# EAGLE design SelfBus DAP Debugger (EAGLE 9.6.2)
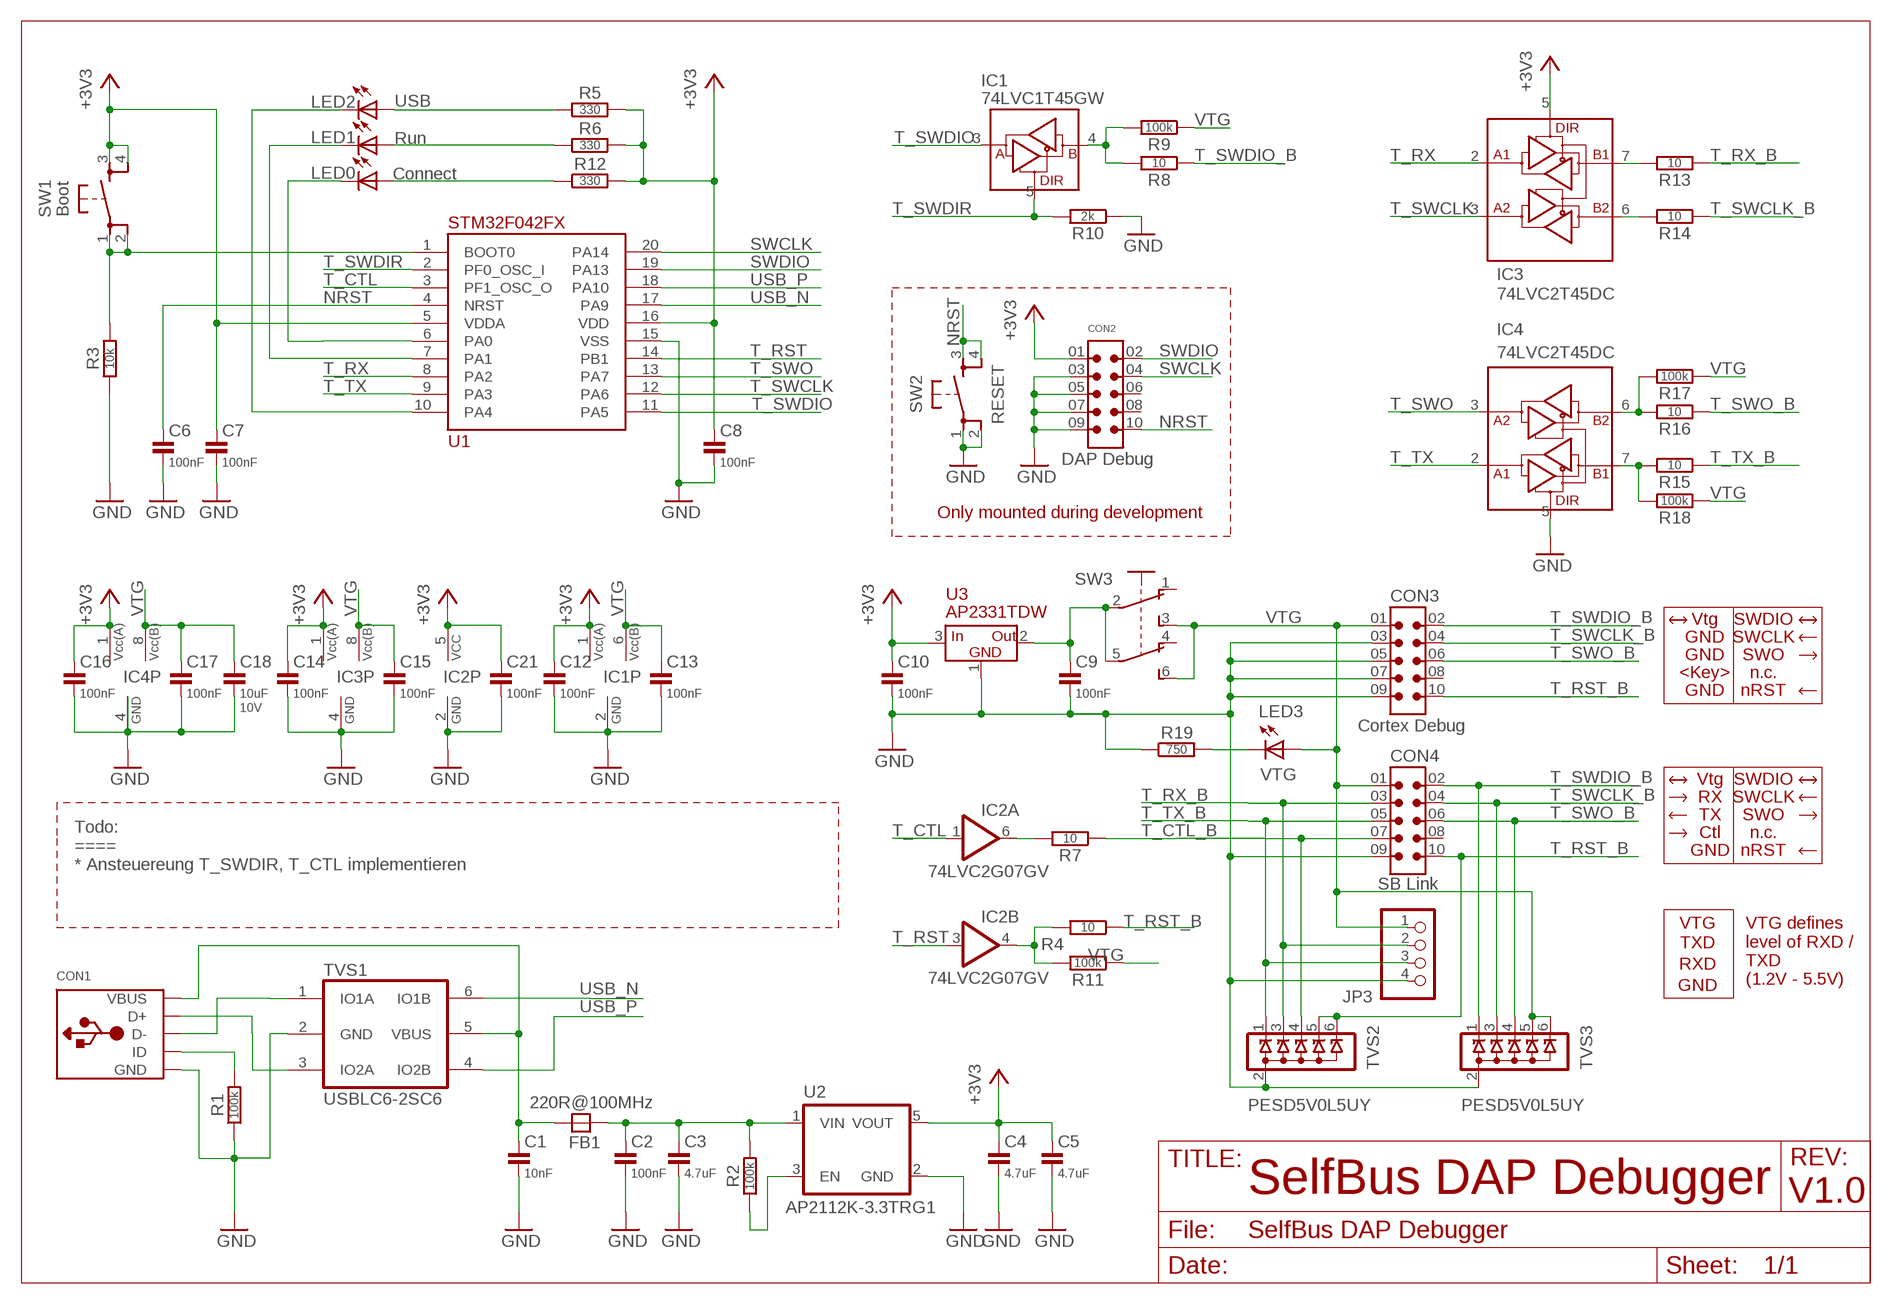
[diagram p0: schematic, sheet 1]

## Parts
C1  10nF  C-EUC0805  [C0805]
C2  100nF  C-EUC0805  [C0805]
C3  4.7uF  C-EUC0805  [C0805]
C4  4.7uF  C-EUC0805  [C0805]
C5  4.7uF  C-EUC0805  [C0805]
C6  100nF  C-EUC0805  [C0805]
C7  100nF  C-EUC0805  [C0805]
C8  100nF  C-EUC0805  [C0805]
C9  100nF  C-EUC0805  [C0805]
C10  100nF  C-EUC0805  [C0805]
C12  100nF  C-EUC0805  [C0805]
C13  100nF  C-EUC0805  [C0805]
C14  100nF  C-EUC0805  [C0805]
C15  100nF  C-EUC0805  [C0805]
C16  100nF  C-EUC0805  [C0805]
C17  100nF  C-EUC0805  [C0805]
C18  10uF  C-EUC0805  [C0805]
C21  100nF  C-EUC0805  [C0805]
CON1  MICRO-B_U254-051N-4BH806  [U254-051N-4BH806]
CON2  SHF-105-01-X-D-TH  [SAMTEC_SHF-105-01-X-D-TH]
CON3  SHF-105-01-X-D-TH  [SAMTEC_SHF-105-01-X-D-TH]
CON4  SAMTEC-LTMM-105-02-T-D  [SAMTEC-LTMM-105-02-T-D]
FB1  220R@100MHz  FB  [FB0805]
IC1  74LVC1T45GW  [SOT363]
IC2  74LVC2G07GV  [SOT23-6]
IC3  74LVC2T45DC  [VSSOP8(0.5)]
IC4  74LVC2T45DC  [VSSOP8(0.5)]
JP3  PINHD-1X4  [1X04]
LED0  Connect  LED_3MM(T1)_GREEN  [LED_3MM_GREEN]
LED1  Run  LED_3MM(T1)_YELLOW  [LED_3MM_YELLOW]
LED2  USB  LED_3MM(T1)_GREEN  [LED_3MM_GREEN]
LED3  VTG  LED_3MM(T1)_RED  [LED_3MM_RED]
R1  100k  R-EU_R0805  [R0805]
R2  100k  R-EU_R0805  [R0805]
R3  10k  R-EU_R0805  [R0805]
R4  10  R-EU_R0805  [R0805]
R5  330  R-EU_R0805  [R0805]
R6  330  R-EU_R0805  [R0805]
R7  10  R-EU_R0805  [R0805]
R8  10  R-EU_R0805  [R0805]
R9  100k  R-EU_R0805  [R0805]
R10  2k  R-EU_R0805  [R0805]
R11  100k  R-EU_R0805  [R0805]
R12  330  R-EU_R0805  [R0805]
R13  10  R-EU_R0805  [R0805]
R14  10  R-EU_R0805  [R0805]
R15  10  R-EU_R0805  [R0805]
R16  10  R-EU_R0805  [R0805]
R17  100k  R-EU_R0805  [R0805]
R18  100k  R-EU_R0805  [R0805]
R19  750  R-EU_R0805  [R0805]
SW1  BOOT  ALPS_SKHHDHA010  [TACT_SWITCH_6X6_SNAP-IN_17]
SW2  RESET  ALPS_SKHHDHA010  [TACT_SWITCH_6X6_SNAP-IN_17]
SW3  XKB7070-Z  [XKB7070]
TVS1  USBLC6-2SC6  [SOT-23-6L]
TVS2  PESD5V0L5UY  [SOT363]
TVS3  PESD5V0L5UY  [SOT363]
U1  STM32F042FX  [TSSOP20]
U2  AP2112K-3.3TRG1  [SOT23-5]
U3  AP2331TDW  [SC59]

## Nets
+3V3: C4.1 C5.1 C7.1 C8.1 C10.1 C12.1 C14.1 C16.1 C21.1 CON2.01 IC1.1(VCC(A)) IC2.5(P:VCC) IC3.1(VCC(A)) IC3.5(DIR) IC4.1(VCC(A)) R5.2 R6.2 R12.2 SW1.3 SW1.4 U1.5(VDDA) U1.16(VDD) U2.5(VOUT) U3.3(IN)
D_N [USB]: CON1.D- TVS1.1(IO1A)
D_P [USB]: CON1.D+ TVS1.3(IO2A)
GND: C1.2 C2.2 C3.2 C4.2 C5.2 C6.2 C7.2 C8.2 C9.2 C10.2 C12.2 C13.2 C14.2 C15.2 C16.2 C17.2 C18.2 C21.2 CON1.GND CON1.SCR@1(GND) CON1.SCR@2(GND) CON1.SCR@3(GND) CON1.SCR@4(GND) CON2.03 CON2.05 CON2.07 CON2.09 CON3.03 CON3.05 CON3.07 CON3.09 CON4.09 IC1.2(GND) IC2.2(P:GND) IC3.4(GND) IC4.4(GND) IC4.5(DIR) JP3.4 R1.1 R3.1 R10.1 R19.1 SW2.1 SW2.2 TVS1.2(GND) TVS2.2(A) TVS3.2(A) U1.15(VSS) U2.2(GND) U3.1(GND)
LED0: LED0.C U1.6(PA0)
LED1: LED1.C U1.7(PA1)
N$3: CON1.ID R1.2
N$4: C1.1 CON1.VBUS FB1.1 TVS1.5(VBUS)
N$6: R2.1 U2.3(EN)
N$7: C2.1 C3.1 FB1.2 R2.2 U2.1(VIN)
N$8: IC2.4(B:OUT) R4.2 R11.2
N$9: IC2.6(A:OUT) R7.2
N$10: R3.2 SW1.1 SW1.2 U1.1(BOOT0)
N$11: LED2.A R5.1
N$12: LED1.A R6.1
N$15: C9.1 SW3.2(P) SW3.5(P) U3.2(OUT)
N$17: LED0.A R12.1
N$18: IC3.7(B1) R13.2
N$19: IC3.6(B2) R14.2
N$20: IC4.6(B2) R16.2 R17.2
N$21: IC4.7(B1) R15.2 R18.2
N$22: IC1.4(B) R8.2 R9.2
N$23: LED2.C U1.10(PA4)
N$24: LED3.C R19.2
NRST: C6.1 CON2.10 SW2.3 SW2.4 U1.4(NRST)
SWCLK: CON2.04 U1.20(PA14)
SWDIO: CON2.02 U1.19(PA13)
T_CTL: IC2.1(A:IN) U1.3(PF1_OSC_O)
T_CTL_B: CON4.07 R7.1 TVS2.4(C3)
T_RST: IC2.3(B:IN) U1.14(PB1)
T_RST_B: CON3.10 CON4.10 R4.1 TVS2.5(C4) TVS2.6(C5)
T_RX: IC3.2(A1) U1.8(PA2)
T_RX_B: CON4.03 JP3.2 R13.1 TVS2.3(C2)
T_SWCLK: IC3.3(A2) U1.12(PA6)
T_SWCLK_B: CON3.04 CON4.04 R14.1 TVS3.3(C2)
T_SWDIO: IC1.3(A) U1.11(PA5)
T_SWDIO_B: CON3.02 CON4.02 R8.1 TVS3.1(C1)
T_SWDIR: IC1.5(DIR) R10.2 U1.2(PF0_OSC_I)
T_SWO: IC4.3(A2) U1.13(PA7)
T_SWO_B: CON3.06 CON4.06 R16.1 TVS3.4(C3)
T_TX: IC4.2(A1) U1.9(PA3)
T_TX_B: CON4.05 JP3.3 R15.1 TVS2.1(C1)
USB_N [USB]: TVS1.6(IO1B) U1.17(PA9)
USB_P [USB]: TVS1.4(IO2B) U1.18(PA10)
VTG: C13.1 C15.1 C17.1 C18.1 CON3.01 CON4.01 IC1.6(VCC(B)) IC3.8(VCC(B)) IC4.8(VCC(B)) JP3.1 LED3.A R9.1 R11.1 R17.1 R18.1 SW3.3(S) SW3.6(S) TVS3.5(C4) TVS3.6(C5)
Unconnected: CON2.06 CON2.08 CON3.08 CON4.08 SW3.1(O) SW3.4(O)

## Notes on the sheet
- Boot
- RESET
- DAP Debug
- Only mounted during development
- Vtg | SWDIO
- GND | SWCLK
- GND | SWO
- <Key> | n.c.
- GND | nRST
- Cortex Debug
- Vtg | SWDIO
- RX | SWCLK
- Todo:
  ====
  * Ansteuereung T_SWDIR, T_CTL implementieren
- TX | SWO
- Ctl | n.c.
- GND | nRST
- SB Link
- VTG defines
  level of RXD /
  TXD
  (1.2V - 5.5V)
- VTG
- TXD
- RXD
- GND
- SelfBus DAP Debugger | V1.0

## Library data of the parts
C1-C10 C12-C17 C21 = MyRCL:C-EU: CAPACITOR, European symbol; SPICEPREFIX: C
C18 = MyRCL:C-EU: CAPACITOR, European symbol; SPICEPREFIX: C; VOLTAGE: 10V
CON1 = MyCon-USB:MICRO-B: USB Micro-B Connector 5pin; LCSC#: C319170
CON2 CON3 = MyCon-Samtec:SHF-105-01-X-D-TH: Connector Header Through Hole 10 position 0.050" (1.27mm)
CON4 = MyCon-Samtec:SAMTEC-LTMM-105-02-T-D
FB1 = MyEMC-Components:FB: FERRITE BEAD; LCSC#2: C139188; MOUSER#: 810-MPZ2012S221ATD25; PART#: MPZ2012S221ATD25; PART#2: CBW201209U221T; PART_MFR: TDK; PART_MFR2: FH
IC1 = MyIC-Logic:74*1T45: 74LVC1T45; 74LVCH1T45 Dual supply translating transceiver; 3-state Single bit, dual supply transceiver with 3-state output for bidirectional level translation. 74LVCH1T45 holds unused or floating data inputs at a valid logiclevel. Datasheet <https://assets.nexperia.com/documents/data-sheet/74LVC_LVCH1T45.pdf>; LCSC#: C478004; LCSC#2: C548484; LCSC#3: C9382; MOUSER#: 771-74LVC1T45GW125; MOUSER#2: 771-74LVC1T45GWQ100H; MOUSER#3: 595-74LVC1T45QDCKRQ1; PART#: 74LVC1T45GW,125; PART#2: 74LVC1T45GW-Q100H; PART#3: SN74LVC1T45DCKR; PART_MFR: NXP; PART_MFR2: NXP; PART_MFR3: TI
IC2 = MyIC-Logic:74*2G07: Double Buffer/Driver with Open-Drain Output; LCSC#: C548568; MOUSER#: 771-LVC2G07GV125; PART#: 74LVC2G07GV,125; PART_MFR: NXP
IC3 = MyIC-Logic:74*2T45: 74LVC2T45; 74LVCH2T45 Dual supply translating transceiver; 3-state Dual bit, dual supply transceiver with 3-state output for bidirectional level translation. 74LVCH2T45 holds unused or floating data inputs at a valid logiclevel. Datasheet <https://assets.nexperia.com/documents/data-sheet/74LVC_LVCH2T45.pdf>; LCSC#: C15741; LCSC#2: C139524; MOUSER#: 595-SN74LVC2T45DCUT; MOUSER#2: 771-74LVCH2T45DC125; PART#: SN74LVC2T45DCU; PART#2: 74LVCH2T45DC,125; PART_MFR: TI; PART_MFR2: NXP
IC4 = MyIC-Logic:74*2T45: 74LVC2T45; 74LVCH2T45 Dual supply translating transceiver; 3-state Dual bit, dual supply transceiver with 3-state output for bidirectional level translation. 74LVCH2T45 holds unused or floating data inputs at a valid logiclevel. Datasheet <https://assets.nexperia.com/documents/data-sheet/74LVC_LVCH2T45.pdf>
JP3 = pinhead:PINHD-1X4: PIN HEADER
LED0 LED2 = SelfBus DAP Debugger:LED_3MM(T1)_GREEN
LED1 = SelfBus DAP Debugger:LED_3MM(T1)_YELLOW
LED3 = SelfBus DAP Debugger:LED_3MM(T1)_RED
R1-R19 = MyRCL:R-EU_: RESISTOR, European symbol
SW1 SW2 = MyTactSwitch:ALPS_SKHH: Tactile Switch 6x6mm Snap-in ALPS SKHH Series <https://tech.alpsalpine.com/prod/e/html/tact/snapin/skhh/skhh_list.html>; LCSC#: C139811; MOUSER#: 688-SKHHDHA010; PART#: SKHHDHA010; PART_MFR: ALPS
SW3 = MyPushSwitch:XKB7070-Z: Latching Push Switch 70x70mm 12.6mm height Datasheet <https://datasheet.lcsc.com/lcsc/2002271810_XKB-Enterprise-XKB7070-Z_C318863.pdf>
TVS1 = usblc6:USBLC6-2: Very low capacitance ESD protection 2 line Features 2 data-line protection Protects V BUS Very low capacitance: 3.5 pF Very low leakage current: 150 nA SOT-666 and SSOT23-6L package RoHS compliant Datasheet <https://www.st.com/resource/en/datasheet/usblc6-2.pdf>; LCSC#2: C2687116; MOUSER#: 511-USBLC6-2SC6; PART#: USBLC6-2SC6; PART#2: USBLC6-2SC6; PART_MFR: STMicroelectronics; PART_MFR2: UMW
TVS2 = MyESD:PESD5V0L5: Low capacitance unidirectional fivefold ESD protection diode array VBR = 6.8V Datasheet <https://assets.nexperia.com/documents/data-sheet/PESDXL5UF_V_Y.pdf>; LCSC#: C179747; MOUSER#: 771-PESD5V0L5UY-T/R; PART#: PESD5V0L5UY; PART_MFR: NXP
TVS3 = MyESD:PESD5V0L5: Low capacitance unidirectional fivefold ESD protection diode array VBR = 6.8V Datasheet <https://assets.nexperia.com/documents/data-sheet/PESDXL5UF_V_Y.pdf>
U1 = STM32F042Fx:STM32F042FX: STM32F042Fx microcontroller; LCSC#: C81002; LCSC#2: C81000; MOUSER#: 511-STM32F042F4P6; MOUSER#2: 511-STM32F042F6P6TR; PART#: STM32F042F4P6; PART#2: STM32F042F6P6; PART_MFR: STMicroelectronics
U2 = MyIC-Regulator:AP2112: AP2112 - 600mA CMOS LDO Regulator with Enable The AP2112 is CMOS process low dropout linear regulator with enable function, the regulator delivers a guaranteed 600mA (min.) continuous load current. Features Output Voltage Accuracy: ±1.5% Output Current: 600mA (Min.) Foldback Short Current Protection: 50mA Enable Function to Turn ON/OFF VOUT Low Dropout Voltage (3.3V): 250mV (Typ.) @IOUT=600mA Excellent Load Regulation: 0.2%/A (Typ.) Excellent Line Regulation: 0.02%/V (Typ.) Low Quiescent Current: 55μA (Typ.) Low Standby Current: 0.01μA (Typ.) Low Output Noise: 50μVRMS PSRR: 100Hz -65dB, 1kHz -65dB OTSD Protection Stable with 1.0μF Flexible Cap: Ceramic, Tantalum and Aluminum Electrolytic Operation Temperature Range: -40°C to 85°C ESD: MM 400V, HBM 4000V; LCSC#: C51118; LCSC#2: C47719; LCSC#3: C296224; MOUSER#: 621-AP2112K-3.3TRG1; MOUSER#2: 865-XC6210B332MR-G; PART#: AP2112K-3.3TRG1; PART#2: XC6210B332MR-G; PART#3: HX6211A332MR
U3 = MyIC-other:AP2331TD: 0.2A Single Channel Current-limited Loads Switch with Output Transient Discharge Quick Turn-off of Output Discharge Path at Power Down Input Voltage Range: 2.7V to 5.2V Fast Short-Circuit Response Time 0.4A Accurate Current Limiting 250mΩ On-Resistance Reverse-Current Blocking Built-In Soft-Start with 0.7ms Typical Turn-On Time Over-Current Protection Over-Voltage Protection Short-Circuit and Thermal Protection ESD Protection: 3kV HBM, 300V MM Ambient Temperature Range: -40°C to +85°C; LCSC#: C460346; MOUSER#: 621-AP2331W-7; PART#: AP2331W-7; PART_MFR: Diodes

## Net classes
1 USB: width 0.406 mm, clearance 0.102 mm

## Board
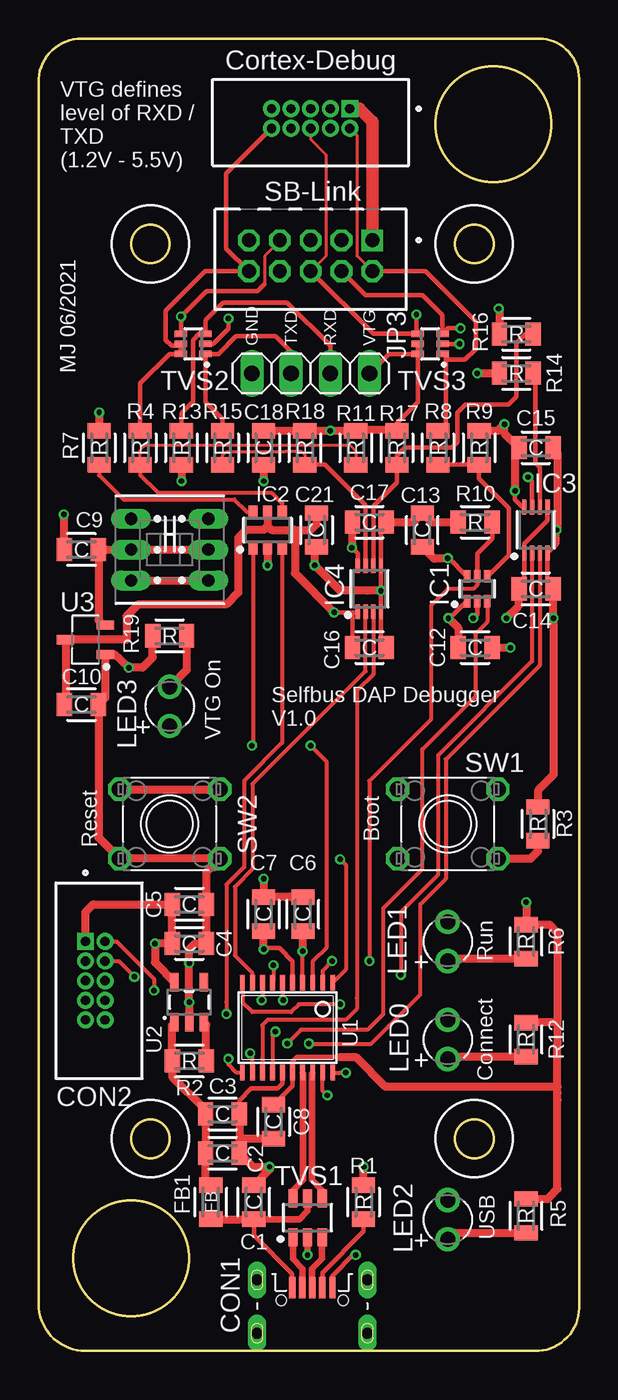
[diagram p1: board, top side]
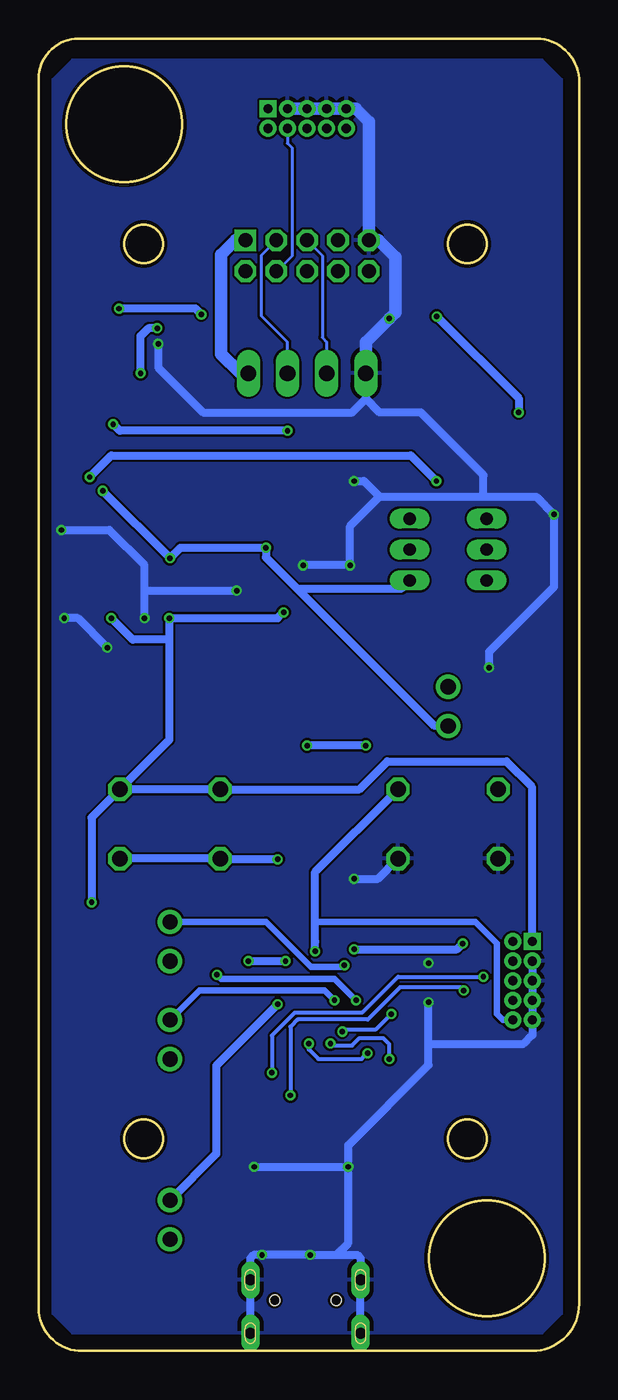
[diagram p2: board, bottom side, seen from below]

Size 35.06 x 85.06 mm. Coordinates in mm from the lower left corner, seen from the top.
Outline: 32.45,0 3.05,0 arc-90 0,3.05 0,82.45 arc-90 3.05,85.05 32.45,85.05 arc-90 35.05,82.45 35.05,3.05 arc-90 32.45,0
Outline: circle at 28.25,13.75 radius 1.25
Outline: circle at 7.25,13.75 radius 1.25
Outline: circle at 29.5,79.5 radius 3.75
Outline: circle at 6,6 radius 3.75
Outline: circle at 7.25,71.75 radius 1.25
Outline: circle at 28.25,71.75 radius 1.25
Copper layers (1*16): Top 0.035mm / dielectric 1.5mm / Bottom 0.035mm
Design rules "aisler_2_layer": minimum track width 0.1mm, minimum drill 0.2mm, track to track 0.15mm, track to pad 0.15mm, pad to pad 0.1mm, via to via 0.1mm, smd to smd 0.1mm, copper to edge 0.2mm, drill to drill 0.21mm, minimum pad ring 0.25mm, minimum via ring 0.15mm, stop-mask expansion 0mil, vias tented up to drill 0mil, thermal gap 10mil

### Footprints (pad centres in the part's own frame; a part is rotated, then mirrored left to right if it is on the bottom)
C0805 = smd 1 x 1.5: 1 -1.1,0; 2 1.1,0
U254-051N-4BH806 = smd 0.4 x 1.4: D+ 0,4.1; D- -0.65,4.1; GND 1.3,4.1; ID 0.65,4.1; VBUS -1.3,4.1 | drill 0.7 pad 1.1 long: SCR@1 -3.575,4.6; SCR@2 -3.575,1.15; SCR@3 3.575,1.15; SCR@4 3.575,4.6 | hole 0.65: -2,3.28; 2,3.28
SAMTEC_SHF-105-01-X-D-TH = drill 0.6 square: 01 -2.54,-0.635 | drill 0.6: 02 -2.54,0.635; 03 -1.27,-0.635; 04 -1.27,0.635; 05 0,-0.635; 06 0,0.635; 07 1.27,-0.635; 08 1.27,0.635; 09 2.54,-0.635; 10 2.54,0.635
SAMTEC-LTMM-105-02-T-D = drill 0.9 square: 01 -4,-1 | drill 0.9 octagon: 02 -4,1; 03 -2,-1; 04 -2,1; 05 0,-1; 06 0,1; 07 2,-1; 08 2,1; 09 4,-1; 10 4,1
FB0805 = smd 1 x 1.5: 1 -1.1,0; 2 1.1,0
SOT363 = smd 0.4 x 0.8: 1 -0.65,-0.8; 2 0,-0.8; 3 0.65,-0.8; 4 0.65,0.8; 5 0,0.8; 6 -0.65,0.8
SOT23-6 = smd 0.6 x 0.9: 1 -0.95,-1.15; 2 0,-1.15; 3 0.95,-1.15; 4 0.95,1.15; 5 0,1.15; 6 -0.95,1.15
VSSOP8(0.5) = smd 0.949 x 0.28: 1 -1.49,0.75; 2 -1.49,0.25; 3 -1.49,-0.25; 4 -1.49,-0.75; 5 1.49,-0.75; 6 1.49,-0.25; 7 1.49,0.25; 8 1.49,0.75
1X04 = drill 1.016 long: 1 -3.81,0; 2 -1.27,0; 3 1.27,0; 4 3.81,0
LED_3MM_GREEN = drill 0.981 pad 1.581: A -1.27,0; C 1.27,0
LED_3MM_YELLOW = drill 0.981 pad 1.581: A -1.27,0; C 1.27,0
LED_3MM_RED = drill 0.981 pad 1.581: A -1.27,0; C 1.27,0
R0805 = smd 1 x 1.5: 1 -1.1,0; 2 1.1,0
TACT_SWITCH_6X6_SNAP-IN_17 = drill 1 octagon: 1 -3.25,2.25; 2 3.25,2.25; 3 -3.25,-2.25; 4 3.25,-2.25
XKB7070 = drill 0.8 long: 1 2.5,2; 2 2.5,0; 3 2.5,-2; 4 -2.5,2; 5 -2.5,0; 6 -2.5,-2
SOT-23-6L = smd 1.165 x 0.597: 1 -1.275,0.95; 2 -1.275,0; 3 -1.275,-0.95; 4 1.275,-0.95; 5 1.275,0; 6 1.275,0.95
TSSOP20 = smd 0.305 x 0.991: 1 -2.925,-2.918; 2 -2.275,-2.918; 3 -1.625,-2.918; 4 -0.975,-2.918; 5 -0.325,-2.918; 6 0.325,-2.918; 7 0.975,-2.918; 8 1.625,-2.918; 9 2.275,-2.918; 10 2.925,-2.918; 11 2.925,2.918; 12 2.275,2.918; 13 1.625,2.918; 14 0.975,2.918; 15 0.325,2.918; 16 -0.325,2.918; 17 -0.975,2.918; 18 -1.625,2.918; 19 -2.275,2.918; 20 -2.925,2.918
SOT23-5 = smd 0.55 x 1.2: 1 -0.95,-1.3; 2 0,-1.3; 3 0.95,-1.3; 4 0.95,1.3; 5 -0.95,1.3
SC59 = smd 1.146 x 0.597: 1 -1.287,0.95; 2 -1.287,-0.95; 3 1.287,0

### Placement (x,y rotation side)
C1  13.96,9.64 90 top
C2  11.93,12.82 0 top
C3  11.93,15.36 0 top
C4  9.77,26.41 0 top
C5  9.77,28.95 0 top
C6  17.14,28.31 90 top
C7  14.6,28.31 90 top
C8  15.23,14.85 270 top
C9  2.79,51.94 180 top
C10  2.79,41.9 0 top
C12  28.31,45.59 0 top
C13  24.88,53.21 90 top
C14  32.25,49.4 0 top
C15  32.25,58.54 0 top
C16  21.45,45.59 0 top
C17  21.45,53.71 0 top
C18  14.6,58.54 270 top
C21  18.03,53.21 270 top
CON1  17.75,0 0 top
CON2  3.67,23.99 270 top
CON3  17.64,79.88 180 top
CON4  17.64,70.98 180 top
FB1  11.17,9.64 90 top
IC1  28.44,49.4 0 top
IC2  14.85,53.21 0 top
IC3  32.25,53.21 90 top
IC4  21.45,49.4 90 top
JP3  17.64,63.37 180 top
LED0  26.54,20.18 90 top
LED1  26.54,26.54 90 top
LED2  26.54,8.5 90 top
LED3  8.5,41.77 90 top
R1  21.07,9.64 270 top
R2  9.77,18.79 180 top
R3  32.38,34.16 270 top
R4  6.6,58.54 270 top
R5  31.61,8.76 90 top
R6  31.61,26.54 90 top
R7  3.93,58.54 270 top
R8  25.9,58.54 270 top
R9  28.57,58.54 270 top
R10  28.31,53.71 0 top
R11  20.57,58.54 270 top
R12  31.61,20.18 90 top
R13  9.26,58.54 270 top
R14  30.98,63.37 0 top
R15  11.93,58.54 270 top
R16  30.98,65.91 0 top
R17  23.23,58.54 270 top
R18  17.26,58.54 270 top
R19  8.5,46.35 0 top
SW1  26.54,34.16 180 top
SW2  8.5,34.16 180 top
SW3  8.5,51.94 0 top
TVS1  17.44,8.63 90 top
TVS2  10.03,65.27 90 top
TVS3  25.39,65.27 90 top
U1  16.15,20.95 180 top
U2  9.77,22.6 0 top
U3  3.04,46.09 180 top

### Tracks (layer width: path | path; a pad name or v marks a point on that pad's centre or on a via)
+3V3  (via drill 0.35)
  Top 0.152: 31.5,49.75 C14.1 31.11,49.35 | 26.68,47.49 v26.58,47.49 | 16.38,53.21 16.63,53.21 | 20.67,47.87 IC4.1 | C10.1 1.75,41.97 | 33.65,19.93 33.65,21.29 | 20.35,47.79 20.44,47.87 | 14.6,26.15 v14.6,26.03 14.68,26.11
  Top 0.305: 31.5,49.75 IC3.1 31.5,52.33 33,53.83 IC3.5 | IC1.1 26.68,47.49 | 20.67,47.87 20.44,47.87 v19.17,47.87 | C8.1 16.47,17.19 U1.16 16.47,18.76 16.76,19.04 19.55,19.04 | C16.1 20.35,47.79 | 14.68,26.11 15.61,26.11 16.47,25.24 U1.5
  Top 0.508: v26.58,47.49 27.21,46.86 C12.1 | IC2.5 14.85,53.46 | 14.85,53.46 15.11,53.21 16.38,53.21 | C21.1 18.03,53.59 17.64,53.21 16.63,53.21 16.63,50.41 v19.17,47.87 | 14.85,53.46 14.6,53.21 13.45,53.21 12.95,52.7 12.95,49.14 12.18,48.38 6.47,48.38 5.71,47.62 5.71,46.09 U3.3 1.75,41.97 | U2.5 7.55,25.17 v7.55,26.41 C4.1 C5.1 3.55,28.95 3.04,28.44 CON2.01 | R5.2 33.01,9.86 33.65,10.49 33.65,16.25 33.65,16.76 33.65,17.14 | 33.65,17.14 33.65,19.93 33.65,27.13 33.14,27.63 R6.2 v31.61,29.07 | 33.65,21.29 R12.2 | v30.34,47.49 31.11,48.25 31.11,49.35 | 14.6,26.15 C7.1 | 33.65,17.14 22.47,17.14 20.57,19.04 19.55,19.04
  Bottom 0.152: CON2.01 3.07,26.57
  Bottom 0.305: v26.58,47.49 26.58,46.09
  Bottom 0.508: v19.17,47.87 19.55,47.49 v26.58,47.49 26.58,39.61 SW1.3 | 26.58,46.09 28.95,46.09 v30.34,47.49 | SW1.3 SW1.4 14.25,36.41 12.44,38.22 4.72,38.22 3.07,36.57 3.07,26.57 | SW1.3 31.61,34.58 v31.61,29.07 | v14.6,26.03 7.93,26.03 v7.55,26.41
D_N
  Top 0.406: TVS1.1 16.49,5.96 17.11,5.34 17.11,4.11 CON1.D-
D_P
  Top 0.406: TVS1.3 18.39,5.96 17.75,5.31 17.75,4.33 CON1.D+
GND  (via drill 0.35)
  Top 0.152: IC4.4 22.2,47.87 | 22.2,45.94 C16.2 | C17.2 22.2,53.36 | 33,49.75 C14.2 33.39,49.35 | C15.2 33.62,58.27 | C21.2 17.9,51.98 | 1.64,51.98 C9.2 | v14.98,11.93 14.98,11.76 | 13.03,13.75 C2.2 | U2.2 9.77,21.45 v9.77,22.6 | v33.58,53.21 33.62,53.21 | C6.2 16.38,29.41
  Top 0.305: v12.31,66.92 12.31,66.25 11.33,65.27 TVS2.2 | v27.3,65.27 TVS3.2 | 22.2,45.94 22.2,47.87 v22.2,49.27 22.2,50.02 IC4.5 22.2,53.36 | 33,49.75 IC3.4 33.62,52.34 33.62,53.21 | CON1.GND 19.05,4.86 20.4,6.21 v20.57,6.21 | C3.2 13.03,16.25 13.79,17.01 15.49,17.01 15.82,17.34 U1.15 | IC1.2 28.44,47.74 v28.19,47.49
  Top 0.406: TVS1.2 v17.44,6.21
  Top 0.508: 33.62,58.27 33.62,53.21 | IC2.2 v14.85,50.92 | 17.9,51.98 v17.9,50.92 19.55,49.27 21.33,49.27 v22.2,49.27 | C17.2 24.29,53.71 C13.2 25.48,53.71 R10.1 | R19.1 7.4,44.95 6.74,44.29 v5.85,44.29 5.83,44.29 4.9,45.15 U3.1 4.33,42.34 C10.2 3.89,33.27 SW2.2 SW2.1 10.87,31.02 C5.2 C4.2 10.15,26.41 9.77,26.03 v9.77,25.14 v9.77,22.6 9.77,21.45 | v1.64,54.22 1.64,51.98 | C18.2 v14.6,56.38 | C1.2 14.98,11.76 | C3.2 C2.2 13.92,11.93 v14.98,11.93 | C8.2 13.03,13.75 | C12.2 v30.6,45.59 | 33.39,49.35 v33.39,47.49 33.39,37.33 32.38,36.31 R3.1 | 16.38,29.41 15.99,29.41 C7.2 v14.6,30.6 | R1.1 v21.07,11.93
  Bottom 0.152: 16.63,6.21 15.74,6.21
  Bottom 0.508: v27.3,65.27 27.3,63.75 24.38,60.83 14.72,60.83 13.84,61.71 | v17.9,50.92 v14.85,50.92 14.85,53.46 12.95,55.36 | 12.95,55.36 9.64,55.36 6.21,55.36 | 6.21,55.36 2.79,55.36 v1.64,54.22 1.64,49.52 5.85,45.31 v5.85,44.29 | JP3.4 13.84,61.71 | 6.21,55.36 6.21,56.76 10.28,60.83 12.95,60.83 13.84,61.71 | 15.74,6.21 14.98,6.98 v14.98,11.93 | CON1.SCR@3 CON1.SCR@4 21.32,6 21.11,6.21 v20.57,6.21 v17.44,6.21 16.63,6.21 14.39,6.21 14.18,6 CON1.SCR@1 CON1.SCR@2 | v33.58,53.21 30.47,53.21 28.19,50.92 28.19,48.63 28.19,47.62 | v28.19,47.49 28.19,47.62 | 28.19,47.62 28.19,49.27 v22.2,49.27 | v30.6,45.59 32.5,47.49 v33.39,47.49 | v14.6,30.6 13.06,30.6 SW2.1 | CON2.03 CON2.05 CON2.07 CON2.09 3.04,20.47 3.61,19.91 9.77,19.91 v9.77,22.6 9.77,18.53 14.98,13.33 v14.98,11.93 | v14.6,56.38 13.96,56.38 12.95,55.36 | v21.07,11.93 v14.98,11.93
  Bottom 0.813: JP3.4 13.84,65.4 v12.31,66.92 11.93,67.3 11.93,70.91 13.01,71.98 CON4.09 13.64,79.68 14.47,80.51 CON3.09 CON3.07 CON3.05 CON3.03
  pour Bottom: 2.41,83.68 32.89,83.68 34.16,82.41 34.16,2.41 32.89,1.14 2.41,1.14 1.14,2.41 1.14,82.41
LED0  (via drill 0.35)
  Top 0.254: U1.6 15.82,22.78 v15.87,22.72
  Bottom 0.406: LED0.C 24.63,23.36 16.5,23.36 v15.87,22.72
LED1  (via drill 0.35)
  Top 0.152: 15.23,23.92 U1.7
  Top 0.254: v15.23,24.99 15.23,23.92
  Bottom 0.406: LED1.C 20.31,27.8 17.39,24.88 15.34,24.88 v15.23,24.99
N$3
  Top 0.305: CON1.ID 18.4,5.07 21.07,7.74 R1.2
N$4
  Top 0.305: CON1.VBUS 16.45,5 13.96,7.49 C1.1
  Top 0.406: C1.1 14.85,8.54 16.91,8.54 17.44,9.08 TVS1.5
  Top 0.508: FB1.1 C1.1
N$6
  Top 0.152: 10.87,21.15 U2.3
  Top 0.508: R2.1 10.87,21.15
N$7
  Top 0.152: FB1.2 10.83,11.08 | C3.1 10.83,15.61 | 8.67,21.15 U2.1
  Top 0.508: 10.83,11.08 C2.1 C3.1 | 10.83,15.61 8.67,17.77 R2.2 8.67,21.15
N$8
  Top 0.152: 20.58,57.42 R11.2 20.58,57.42
  Top 0.203: R11.2 20.57,58.33 20.18,58.72 6.94,58.72 6.6,58.38 R4.2
  Top 0.254: R4.2 6.6,56.76 7.74,55.62 15.11,55.62 15.8,54.92 IC2.4
N$9
  Top 0.254: IC2.6 13.52,54.36 12.69,55.19 5.5,55.19 3.93,56.76 R7.2
N$10  (via drill 0.35)
  Top 0.254: U1.1 19.93,24.72 19.93,31.49 v19.55,31.87
  Top 0.508: SW1.1 31.9,31.9 32.38,32.38 R3.2
  Bottom 0.152: SW1.2 23.99,31.9 23.96,31.87
  Bottom 0.508: 23.99,31.9 SW1.1 | v19.55,31.87 23.96,31.87
N$11
  Top 0.508: LED2.A 26.96,7.66 R5.1
N$12
  Top 0.508: LED1.A 26.7,25.43 R6.1
N$15
  Top 0.152: 4.2,47.04 U3.2
  Top 0.508: 4.2,47.04 3.89,47.36 C9.1 SW3.5 SW3.2
N$17
  Top 0.508: LED0.A 26.7,19.08 R12.1
N$18  (via drill 0.35)
  Top 0.305: IC3.7 32,56.38 v31.74,56.63
  Top 0.508: R13.2 v9.26,56.38
  Bottom 0.508: v31.74,56.63 30.34,58.03 10.91,58.03 v9.26,56.38
N$19
  Top 0.152: 32.21,63.24 R14.2
  Top 0.305: IC3.6 32.5,57.27 32.21,57.57 32.21,63.24
N$20
  Top 0.305: R16.2 31.57,65.91 30.98,65.31 30.98,61.84 30.47,61.33 27.68,61.33 27.17,60.83 27.17,58.92 26.79,58.54 23.74,58.54 23.23,58.03 R17.2 23.23,56.3 21.7,54.77 IC4.6
N$21
  Top 0.203: R15.2 11.93,58.03 12.18,58.29 15.99,58.29 17.05,58.29 17.26,58.07 R18.2
  Top 0.305: R18.2 18.58,57.44 21.2,54.82 IC4.7
N$22
  Top 0.305: R8.2 R9.2 28.57,56.55 30.49,54.63 30.49,51.59 IC1.4
N$23  (via drill 0.35)
  Top 0.152: U1.10 13.24,23.85
  Top 0.254: 13.24,23.85 13.24,22.59 13.87,21.96 16.38,21.96 16.88,22.47 v19.55,22.47
  Bottom 0.508: v19.55,22.47 23.55,18.47 23.55,12.76 LED2.C
N$24
  Top 0.508: R19.2 9.6,44.15 LED3.C
NRST  (via drill 0.35)
  Top 0.254: U1.4 v17.12,25.9 | C6.1 17.12,27.2
  Top 0.508: SW2.4 SW2.3 | 17.12,27.2 v17.12,25.9
  Bottom 0.406: CON2.10 4.95,21.45 5.33,21.84 5.33,26.41 6.72,27.8 17.12,27.8
  Bottom 0.508: v17.12,25.9 17.12,26.54 17.12,27.8 17.12,31.04 SW2.3
SWCLK  (via drill 0.35)
  Top 0.152: 19.55,18.03
  Top 0.254: CON2.04 5.2,25.26 v6.21,24.25 | v19.93,18.03 19.55,18.03 | U1.20 19.55,18.03
  Bottom 0.254: v6.21,24.25 11.75,24.25 14.09,21.91 18.46,21.91 19.93,20.44 v19.93,18.03
SWDIO  (via drill 0.35)
  Top 0.254: CON2.02 5.07,26.54 7.49,24.12 v7.49,23.36 | v18.72,16.57 18.42,16.87 U1.19
  Bottom 0.254: v18.72,16.57 18.72,21.01 18.25,21.48 13.71,21.48 11.6,23.59 7.71,23.59 v7.49,23.36
T_CTL  (via drill 0.35)
  Top 0.152: 13.9,39.3 v13.84,39.23
  Top 0.254: IC2.1 13.9,39.3 | v17.64,39.23 18.66,38.22 18.66,26.12 17.77,25.23 U1.3
  Bottom 0.508: v13.84,39.23 v17.64,39.23
T_CTL_B  (via drill 0.35)
  Top 0.152: TVS2.4
  Top 0.203: CON4.07 15.64,71.94 14.66,70.96 14.66,69.14
  Top 0.305: TVS2.4 v9.23,67.05 10.89,68.7 14.22,68.7 14.66,69.14
  Top 0.508: v3.93,60.83 R7.1
  Bottom 0.508: v9.23,67.05 3.93,61.74 v3.93,60.83
T_RST  (via drill 0.35)
  Top 0.152: v15.36,20.69 15.17,20.5
  Top 0.254: IC2.3 15.8,39.42 13.33,36.95 13.33,31.36 12.18,30.22 12.18,22.6 v12.18,21.84 | 15.17,20.5 U1.14
  Bottom 0.152: v15.36,20.69 15.21,20.84
  Bottom 0.254: v12.18,21.84 13.18,20.84 15.21,20.84
T_RST_B
  Top 0.152: 9.1,65.14 TVS2.5
  Top 0.305: CON3.10 12.17,76.31 12.17,71.46 CON4.10 10.8,69.98 8.25,67.43 8.25,65.52 8.63,65.14 9.1,65.14 | TVS2.5 TVS2.6 8.49,64.62 6.6,62.73 R4.1
T_RX  (via drill 0.35)
  Top 0.152: 23.49,24.5 v23.49,24.38 | U1.8
  Top 0.254: IC3.2 32,44.7 25.9,38.6 25.9,30.85 23.49,28.44 23.49,24.5 | U1.8 14.52,22.78 v14.47,22.72
  Bottom 0.406: v23.49,24.38 23.23,24.12 15.87,24.12 v14.47,22.72
T_RX_B
  Top 0.152: TVS2.3 10.42,65.92
  Top 0.305: JP3.2 18.91,65.14 16.11,67.95 11.97,67.95 10.83,66.81 TVS2.3 | 10.42,65.92 10.03,65.52 10.03,61.54 9.26,60.78 R13.1
  Bottom 0.203: CON4.03 20.63,71 20.63,67.11 18.91,65.4 JP3.2
T_SWCLK  (via drill 0.35)
  Top 0.152: U1.12 13.86,18.04
  Top 0.254: IC3.3 32.5,44.44 26.41,38.35 26.41,30.6 24.76,28.95 24.76,23.11 21.57,19.92 v17.53,19.92 | v13.73,19.3 13.86,19.16 13.86,18.04
  Bottom 0.254: v13.73,19.3 14.11,18.91 16.91,18.91 17.53,19.54 v17.53,19.92
T_SWCLK_B  (via drill 0.35)
  Top 0.305: CON4.04 21.2,68.43 24.88,68.43 26.19,67.12 TVS3.3 26.56,66.29 v27.36,66.29
  Top 0.508: v28.44,63.37 R14.1
  Bottom 0.152: 19.59,69.98 CON4.04
  Bottom 0.203: CON3.04 18.91,78.27 18.64,78 18.64,70.94 19.59,69.98
  Bottom 0.508: v28.44,63.37 28.44,65.78 27.93,66.29 v27.36,66.29
T_SWDIO  (via drill 0.35)
  Top 0.254: IC1.3 29.09,47.25 28.31,46.47 28.31,42.41 24.88,38.98 24.88,31.23 22.35,28.7 22.35,21.83 21.34,20.81 17.02,20.81 v16.13,19.92 | v12.31,18.91 12.31,18.56 12.84,18.03 U1.11
  Bottom 0.254: v16.13,19.92 16,19.8 14.73,19.8 14.24,20.28 12.71,20.28 12.31,19.88 v12.31,18.91
T_SWDIO_B
  Top 0.152: 26.57,64.24 TVS3.1 26.41,64.62
  Top 0.203: CON3.02 20.64,78.78 20.64,70.98 CON4.02
  Top 0.305: 26.57,64.24 27.64,64.24 28.34,64.94 28.34,66.72 25.08,69.98 CON4.02 | 26.41,64.62 26.41,60.15 R8.1
T_SWDIR  (via drill 0.35)
  Top 0.254: IC1.5 28.44,49.65 28.19,49.4 26.54,49.4 25.44,48.3 25.44,40.93 21.45,36.94 v21.45,25.26 | v19.04,25.26 18.42,24.64 U1.2
  Top 0.305: R10.2 29.41,52.65 28.44,51.68 IC1.5
  Bottom 0.508: v21.45,25.26 v19.04,25.26
T_SWO
  Top 0.254: IC4.3 21.7,43.85 20.64,42.79 20.64,22.85 20.64,22.17 19.93,21.45 14.85,21.45 14.52,21.12 14.52,18.98 U1.13
T_SWO_B  (via drill 0.35)
  Top 0.152: TVS3.4 24.5,66.01 | v29.84,67.56 29.88,67.51
  Top 0.203: CON3.06 17.64,78.53 18.63,77.55 18.63,70.97 CON4.06
  Top 0.305: CON4.06 21.71,65.92 23.36,65.92 TVS3.4 | 24.5,66.01 v24.5,67.17
  Top 0.508: 29.88,67.51 R16.1
  Bottom 0.508: v24.5,67.17 24.88,67.56 v29.84,67.56
T_TX
  Top 0.254: U1.9 13.87,24.5 12.73,25.64 12.73,30.09 13.87,31.23 13.87,36.73 21.2,44.07 IC4.2
T_TX_B
  Top 0.305: JP3.3 16.38,64.76 15.36,65.78 12.82,65.78 11.66,64.62 TVS2.1 10.83,61.51 11.93,60.4 R15.1
  Bottom 0.203: CON4.05 16.65,70.99 16.65,65.68 16.38,65.4 JP3.3
USB_N
  Top 0.406: TVS1.6 16.49,10.41 17.16,11.08 17.16,17.99 U1.17
USB_P
  Top 0.406: TVS1.4 18.39,10.41 17.72,11.08 17.72,17.98 U1.18
VTG  (via drill 0.35)
  Top 0.152: 26.6,51.38 v26.54,51.38 26.49,51.34 | 30.9,58.29 C15.1 | v20.31,52.06 20.35,52.11 | R11.1 20.61,59.68 | R17.1 23.19,59.68
  Top 0.305: IC1.6 26.6,51.38 | IC3.8 31.37,54.7 30.9,55.17 v30.9,55.75 | v20.31,52.06 20.7,51.67 IC4.8 | TVS3.6 TVS3.5 | JP3.1 22.71,64.62 TVS3.6 | TVS3.6 24.59,61.51 23.23,60.15 R17.1
  Top 0.508: R11.1 v18.91,59.64 R18.1 C18.1 | R9.1 29.79,59.64 v30.22,60.06 30.22,59.47 C15.1 | 30.9,58.29 v30.9,55.75 | C13.1 25.65,51.34 26.49,51.34 | 20.35,52.11 C17.1 | 23.19,59.68 20.61,59.68 | SW3.6 SW3.3
  Top 0.813: CON3.01 20.82,80.51 21.64,79.68 CON4.01
  Bottom 0.508: v30.9,55.75 v26.54,51.38 25.86,52.06 v20.31,52.06 20.31,51.43 18.31,49.43 | 18.31,49.43 11.51,49.43 SW3.3 | v18.91,59.64 29.79,59.64 v30.22,60.06 | LED3.A 9.39,40.51 18.31,49.43
  Bottom 0.813: CON4.01 22.28,71.98 23.21,71.05 23.21,64.61 21.96,63.37 JP3.1

### Text on the board
tPlace: Cortex-Debug | VTG defines / level of RXD / / TXD / (1.2V - 5.5V) | SB-Link | GND | TXD | RXD | VTG | MJ 06/2021 | Selfbus DAP Debugger / V1.0 | VTG On | Reset | Boot | Run | Connect | USB